# Altium project ZNEO-Z20X.PrjPcb
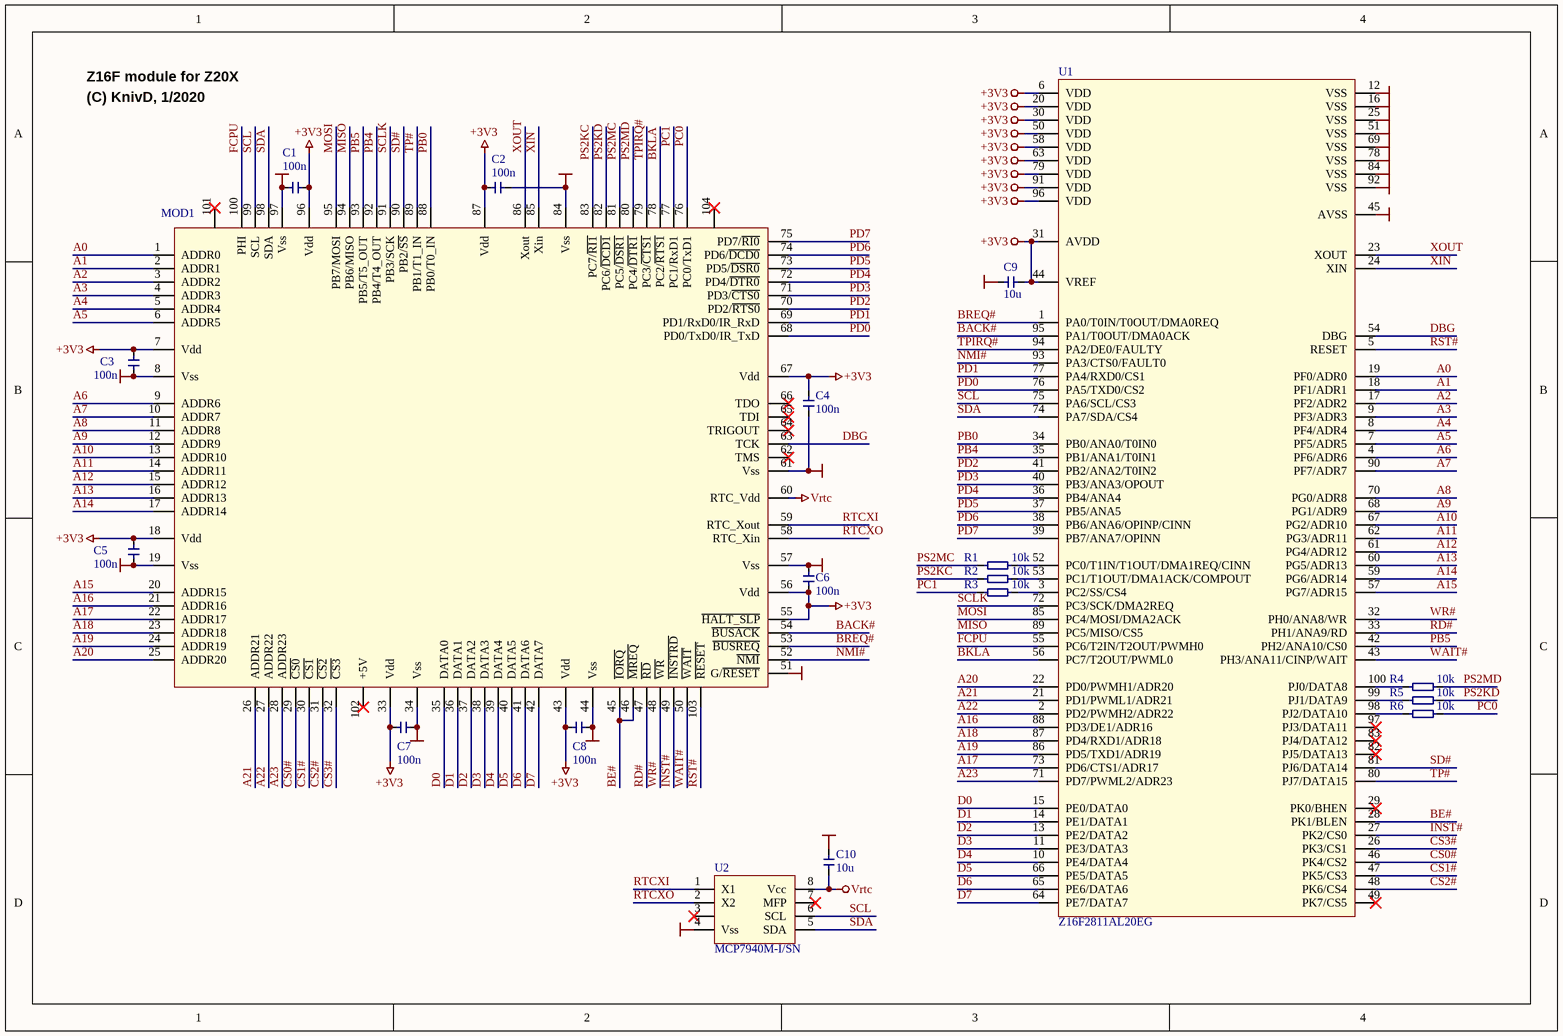
[diagram p0: main.SchDoc]
1 sheet, 19 parts. Net scope: global (net labels, ports and power ports of the same name join across sheets).
Board file: PCB.PcbDoc

## Sheet main.SchDoc: ELLO TROLL
size A4; Author: KnivD; DrawnBy: KnivD; Engineer: KnivD; DocumentNumber: 1; Revision: 1704; SheetNumber: 1; SheetTotal: 1; ProjectName: ELLO TROLL

### Parts
C1  100n  [_0805_CAP]
C2  100n  [_0805_CAP]
C3  100n  [_0805_CAP]
C4  100n  [_0805_CAP]
C5  100n  [_0805_CAP]
C6  100n  [_0805_CAP]
C7  100n  [_0805_CAP]
C8  100n  [_0805_CAP]
C9  10u  [_0805_CAP]
C10  10u  [_0805_CAP]
MOD1  Z20X CPU Module  [PGA100X15]  (value not drawn)
R1  10k  [_0805_RES]
R2  10k  [_0805_RES]
R3  10k  [_0805_RES]
R4  10k  [_0805_RES]
R5  10k  [_0805_RES]
R6  10k  [_0805_RES]
U1  Z16F2811AL20EG  [QFP50P1600X1600X170-100N]
U2  MCP7940M-I/SN  [SOIC8]

### Nets
+3V3: C1.1 C2.2 C3.1 C4.2 C5.1 C6.1 C7.1 C8.1 C9.1 MOD1.7(Vdd) MOD1.18(Vdd) MOD1.33(Vdd) MOD1.43(Vdd) MOD1.55(~{HALT_SLP}) MOD1.56(Vdd) MOD1.67(Vdd) MOD1.87(Vdd) MOD1.96(Vdd) U1.6(VDD) U1.20(VDD) U1.30(VDD) U1.31(AVDD) U1.44(VREF) U1.50(VDD) U1.58(VDD) U1.63(VDD) U1.79(VDD) U1.91(VDD) U1.96(VDD)
GND: C1.2 C2.1 C3.2 C4.1 C5.2 C6.2 C7.2 C8.2 C9.2 C10.1 MOD1.8(Vss) MOD1.19(Vss) MOD1.34(Vss) MOD1.44(Vss) MOD1.51(G/~{RESET}) MOD1.57(Vss) MOD1.61(Vss) MOD1.84(Vss) MOD1.97(Vss) U1.12(VSS) U1.16(VSS) U1.25(VSS) U1.45(AVSS) U1.51(VSS) U1.69(VSS) U1.78(VSS) U1.84(VSS) U1.92(VSS) U2.4(Vss)
Vrtc: C10.2 MOD1.60(RTC_Vdd) U2.8(Vcc)
A0: MOD1.1(ADDR0) U1.19(PF0/ADR0)
A1: MOD1.2(ADDR1) U1.18(PF1/ADR1)
A2: MOD1.3(ADDR2) U1.17(PF2/ADR2)
A3: MOD1.4(ADDR3) U1.9(PF3/ADR3)
A4: MOD1.5(ADDR4) U1.8(PF4/ADR4)
A5: MOD1.6(ADDR5) U1.7(PF5/ADR5)
A6: MOD1.9(ADDR6) U1.4(PF6/ADR6)
A7: MOD1.10(ADDR7) U1.90(PF7/ADR7)
A8: MOD1.11(ADDR8) U1.70(PG0/ADR8)
A9: MOD1.12(ADDR9) U1.68(PG1/ADR9)
A10: MOD1.13(ADDR10) U1.67(PG2/ADR10)
A11: MOD1.14(ADDR11) U1.62(PG3/ADR11)
A12: MOD1.15(ADDR12) U1.61(PG4/ADR12)
A13: MOD1.16(ADDR13) U1.60(PG5/ADR13)
A14: MOD1.17(ADDR14) U1.59(PG6/ADR14)
A15: MOD1.20(ADDR15) U1.57(PG7/ADR15)
A16: MOD1.21(ADDR16) U1.88(PD3/DE1/ADR16)
A17: MOD1.22(ADDR17) U1.73(PD6/CTS1/ADR17)
A18: MOD1.23(ADDR18) U1.87(PD4/RXD1/ADR18)
A19: MOD1.24(ADDR19) U1.86(PD5/TXD1/ADR19)
A20: MOD1.25(ADDR20) U1.22(PD0/PWMH1/ADR20)
A21: MOD1.26(ADDR21) U1.21(PD1/PWML1/ADR21)
A22: MOD1.27(ADDR22) U1.2(PD2/PWMH2/ADR22)
A23: MOD1.28(ADDR23) U1.71(PD7/PWML2/ADR23)
BACK#: MOD1.54(~{BUSACK}) U1.95(PA1/T0OUT/DMA0ACK)
BE#: MOD1.45(~{IORQ}) MOD1.46(~{MREQ}) U1.28(PK1/BLEN)
BKLA: MOD1.78(PC2/~{RTS1}) U1.56(PC7/T2OUT/PWML0)
BREQ#: MOD1.53(~{BUSREQ}) U1.1(PA0/T0IN/T0OUT/DMA0REQ)
CS0#: MOD1.29(~{CS0}) U1.46(PK4/CS2)
CS1#: MOD1.30(~{CS1}) U1.47(PK5/CS3)
CS2#: MOD1.31(~{CS2}) U1.48(PK6/CS4)
CS3#: MOD1.32(~{CS3}) U1.26(PK3/CS1)
D0: MOD1.35(DATA0) U1.15(PE0/DATA0)
D1: MOD1.36(DATA1) U1.14(PE1/DATA1)
D2: MOD1.37(DATA2) U1.13(PE2/DATA2)
D3: MOD1.38(DATA3) U1.11(PE3/DATA3)
D4: MOD1.39(DATA4) U1.10(PE4/DATA4)
D5: MOD1.40(DATA5) U1.66(PE5/DATA5)
D6: MOD1.41(DATA6) U1.65(PE6/DATA6)
D7: MOD1.42(DATA7) U1.64(PE7/DATA7)
DBG: MOD1.63(TCK) U1.54(DBG)
FCPU: MOD1.100(PHI) U1.55(PC6/T2IN/T2OUT/PWMH0)
INST#: MOD1.49(~{INSTRD}) U1.27(PK2/CS0)
MISO: MOD1.94(PB6/MISO) U1.89(PC5/MISO/CS5)
MOSI: MOD1.95(PB7/MOSI) U1.85(PC4/MOSI/DMA2ACK)
NMI#: MOD1.52(~{NMI}) U1.93(PA3/CTS0/FAULT0)
PB0: MOD1.88(PB0/T0_IN) U1.34(PB0/ANA0/T0IN0)
PB4: MOD1.92(PB4/T4_OUT) U1.35(PB1/ANA1/T0IN1)
PB5: MOD1.93(PB5/T5_OUT) U1.42(PH2/ANA10/CS0)
PC0: MOD1.76(PC0/TxD1) R6.1
PC1: MOD1.77(PC1/RxD1) R3.2
PD0: MOD1.68(PD0/TxD0/IR_TxD) U1.76(PA5/TXD0/CS2)
PD1: MOD1.69(PD1/RxD0/IR_RxD) U1.77(PA4/RXD0/CS1)
PD2: MOD1.70(PD2/~{RTS0}) U1.41(PB2/ANA2/T0IN2)
PD3: MOD1.71(PD3/~{CTS0}) U1.40(PB3/ANA3/OPOUT)
PD4: MOD1.72(PD4/~{DTR0}) U1.36(PB4/ANA4)
PD5: MOD1.73(PD5/~{DSR0}) U1.37(PB5/ANA5)
PD6: MOD1.74(PD6/~{DCD0}) U1.38(PB6/ANA6/OPINP/CINN)
PD7: MOD1.75(PD7/~{RI0}) U1.39(PB7/ANA7/OPINN)
PS2KC: MOD1.83(PC7/~{RI1}) R2.2
PS2KD: MOD1.82(PC6/~{DCD1}) R5.1
PS2MC: MOD1.81(PC5/~{DSR1}) R1.2
PS2MD: MOD1.80(PC4/~{DTR1}) R4.1
RD#: MOD1.47(~{RD}) U1.33(PH1/ANA9/RD)
RST#: MOD1.103(~{RESET}) U1.5(RESET)
RTCXI: MOD1.59(RTC_Xout) U2.1(X1)
RTCXO: MOD1.58(RTC_Xin) U2.2(X2)
SCL: MOD1.99(SCL) U1.75(PA6/SCL/CS3) U2.6(SCL)
SCLK: MOD1.91(PB3/SCK) U1.72(PC3/SCK/DMA2REQ)
SD#: MOD1.90(PB2/~{SS}) U1.81(PJ6/DATA14)
SDA: MOD1.98(SDA) U1.74(PA7/SDA/CS4) U2.5(SDA)
TP#: MOD1.89(PB1/T1_IN) U1.80(PJ7/DATA15)
TPIRQ#: MOD1.79(PC3/~{CTS1}) U1.94(PA2/DE0/FAULTY)
WAIT#: MOD1.50(~{WAIT}) U1.43(PH3/ANA11/CINP/WAIT)
WR#: MOD1.48(~{WR}) U1.32(PH0/ANA8/WR)
XIN: MOD1.85(Xin) U1.24(XIN)
XOUT: MOD1.86(Xout) U1.23(XOUT)
NetR1_1: R1.1 U1.52(PC0/T1IN/T1OUT/DMA1REQ/CINN)
NetR2_1: R2.1 U1.53(PC1/T1OUT/DMA1ACK/COMPOUT)
NetR3_1: R3.1 U1.3(PC2/SS/CS4)
NetR4_2: R4.2 U1.100(PJ0/DATA8)
NetR5_2: R5.2 U1.99(PJ1/DATA9)
NetR6_2: R6.2 U1.98(PJ2/DATA10)

Not connected (* = marked no-connect by the designer): MOD1 62(TMS)* 64(TRIGOUT)* 65(TDI)* 66(TDO)* 101* 102(+5V)* 104*; U1 29(PK0/BHEN)* 49(PK7/CS5)* 82(PJ5/DATA13)* 83(PJ4/DATA12)* 97(PJ3/DATA11)*; U2 3* 7(MFP)*

### Notes on the sheet
- Z16F module for Z20X
- (C) KnivD, 1/2020

### Library data of the parts
C1-C10 = Capacitor
R1-R6 = Resistor
U1 = Z16F (QFP100): 16-bit microcontroller/microprocessor; Manufacturer: Zilog
U2 = MCP7940M: Low-Cost I2C™ Real-Time Clock/Calendar with SRAM; Manufacturer: Microchip